# Altium project esp32-s3-can-interface.PrjPcb
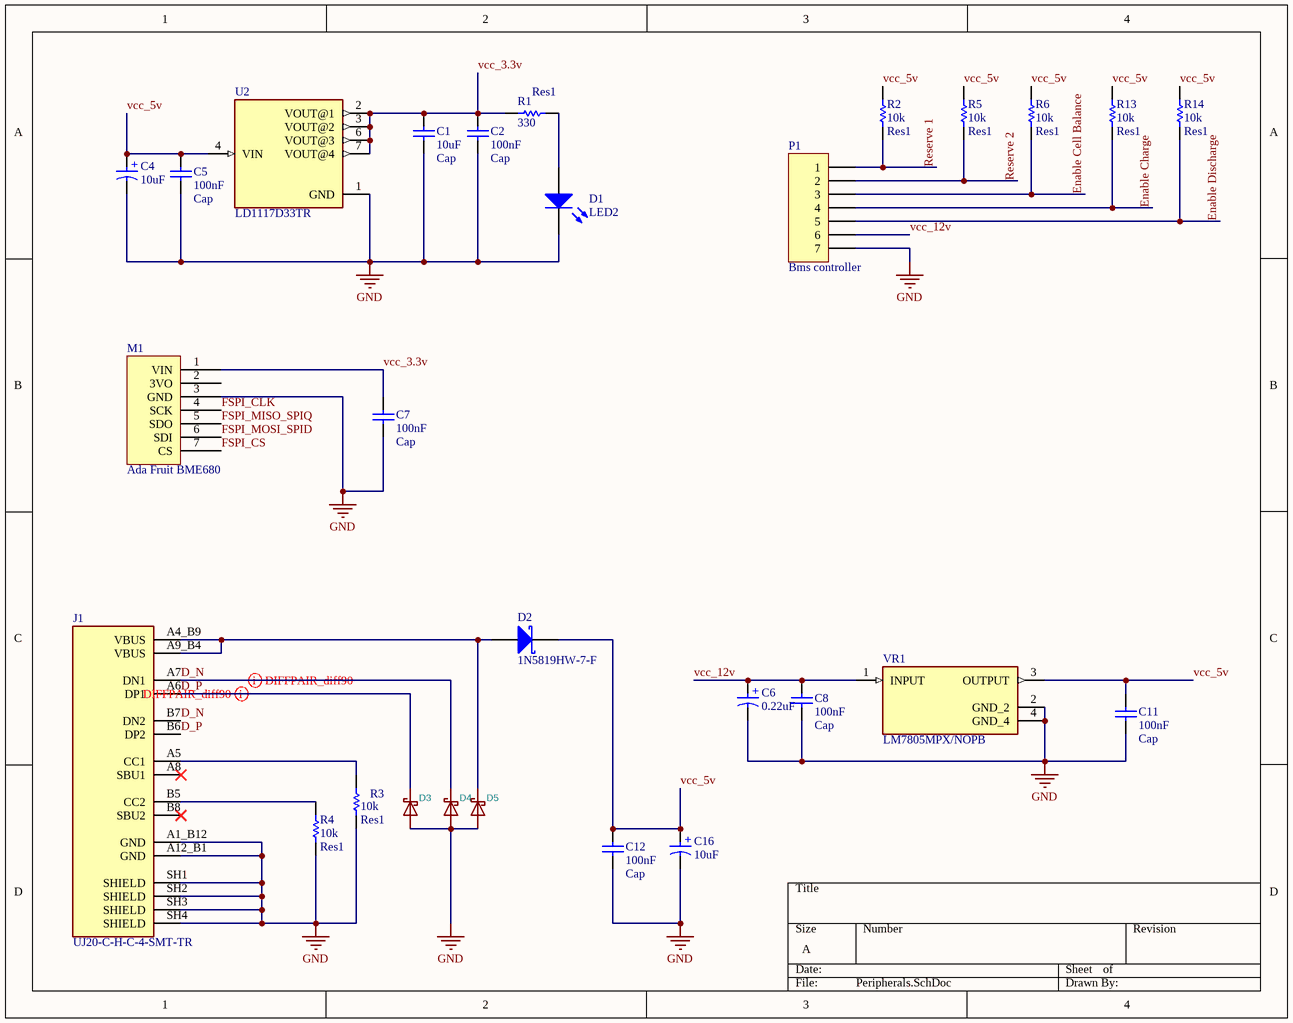
[diagram p0: Peripherals.SchDoc]
2 sheets, 48 parts. Net scope: global (net labels, ports and power ports of the same name join across sheets).
Board file: main.PcbDoc
Sheets:
  Peripherals.SchDoc
  ESP32.SchDoc

## Sheet Peripherals.SchDoc
size A; SheetNumber: 1; SheetTotal: 2; SPICEModelCacheRTTYEORK: <root> / <DocumentId>RTTYEORK</DocumentId> / <CacheFrame Number="0"> / <Model Name="led2" Kind="MDL"> / <Text>*Typ RED,GREEN,YELLOW,AMBER GaAs LED: Vf=2.1V Vr=4V If=40mA trr=3uS / *LED Pinout: 1=A, 2=K / .MODEL LED2 D (IS=93.1P RS=42M N=4.61 BV=4 IBV=10U / + CJO=2.97P VJ=.75 M=.333 TT=4.32U)</Text> / </Model> / <Model Name="skydiode" Kind="MDL"> / <Text>*Default Schottky Diode / *Schottky Diode Pinout: A,K / .MODEL SKYDIODE D(EG=0.69 XTI=2)</Text> / </Model> / <Model Name="865060643005_10uf" Kind="CKT"> / <Text>******* / .subckt 865060643005_10uF 1 2 / Rser 1 3 0.86 / Lser 2 4 0.000000002536 / C1 3 4 0.00001 / Rpar 3 4 10000000 / .ends 865060643005_10uF</Text> / </Model> / </CacheFrame> / </root>

### Parts
C1  Cap  value 10uF  [6-0805_L]
C2  Cap  value 100nF  [6-0805_L]
C4  10uF  [WCAP-ASLL_D6.3H5.5]
C5  Cap  value 100nF  [6-0805_L]
C6  0.22uF  [WCAP-ASLL_D6.3H5.5]
C7  Cap  value 100nF  [6-0805_L]
C8  Cap  value 100nF  [6-0805_L]
C11  Cap  value 100nF  [6-0805_L]
C12  Cap  value 100nF  [6-0805_L]
C16  10uF  [WCAP-ASLL_D6.3H5.5]
D1  LED2  [6-0805_N]
D2  1N5819HW-7-F  [SMB]
D3  Schottky-Diode  [SOD-523]  (value not drawn)
D4  Schottky-Diode  [SOD-523]  (value not drawn)
D5  Schottky-Diode  [SOD-523]  (value not drawn)
J1  UJ20-C-H-C-4-SMT-TR  [CUI_UJ20-C-H-C-4-SMT-TR]
M1  Ada Fruit BME680  [Ada Fruit BME680]
P1  Bms controller  [HDR1X7]
R1  Res1  value 330  [6-0805_N]
R2  Res1  value 10k  [6-0805_N]
R3  Res1  value 10k  [6-0805_N]
R4  Res1  value 10k  [6-0805_N]
R5  Res1  value 10k  [6-0805_N]
R6  Res1  value 10k  [6-0805_N]
R13  Res1  value 10k  [6-0805_N]
R14  Res1  value 10k  [6-0805_N]
U2  LD1117D33TR  [SOIC127P600X175-8N]
VR1  LM7805MPX/NOPB  [VREG_LM7805MPX/NOPB]

### Nets
GND: C1.1 C2.1 C4.2(N) C5.1 C6.2(N) C7.1 C8.1 C11.1 C12.1 C16.2(N) D1.2(K) D3.A D4.A D5.A J1.A1_B12(GND) J1.A12_B1(GND) J1.SH1(SHIELD) J1.SH2(SHIELD) J1.SH3(SHIELD) J1.SH4(SHIELD) M1.3(GND) P1.7 R3.1 R4.1 U2.1(GND) VR1.2(GND_2) VR1.4(GND_4)
D_N: D4.K J1.A7(DN1) J1.B7(DN2)
D_P: D3.K J1.A6(DP1) J1.B6(DP2)
Enable Cell Balance: P1.3 R6.1
Enable Charge: P1.4 R13.1
Enable Discharge: P1.5 R14.1
FSPI_CLK: M1.4(SCK)
FSPI_CS: M1.7(CS)
FSPI_MISO_SPIQ: M1.5(SDO)
FSPI_MOSI_SPID: M1.6(SDI)
Reserve 1: P1.1 R2.1
Reserve 2: P1.2 R5.1
vcc_3.3v: C1.2 C2.2 C7.2 M1.1(VIN) R1.1 U2.2(VOUT@1) U2.3(VOUT@2) U2.6(VOUT@3) U2.7(VOUT@4)
vcc_5v: C4.1(P) C5.2 C11.2 C12.2 C16.1(P) D2.2(K) R2.2 R5.2 R6.2 R13.2 R14.2 U2.4(VIN) VR1.3(OUTPUT)
vcc_12v: C6.1(P) C8.2 P1.6 VR1.1(INPUT)
NetD1_1: D1.1(A) R1.2
NetD2_1: D2.1(A) D5.K J1.A4_B9(VBUS) J1.A9_B4(VBUS)
NetJ1_A5: J1.A5(CC1) R3.2
NetJ1_B5: J1.B5(CC2) R4.2

Not connected (* = marked no-connect by the designer): J1 A8(SBU1)* B8(SBU2)*; M1 2(3VO)

### Layout directives
differential pair; differential pair class diff90: D_N, D_P

### Notes on the sheet
- (in symbol 865060643005) +

### Library data of the parts
C1 C2 C5 C7 C8 C11 C12 = Cap: Capacitor; Published: 8-Jun-2000; LatestRevisionDate: 17-Jul-2002; LatestRevisionNote: Re-released for DXP Platform.; PackageReference: RAD-0.3; Publisher: Altium Limited; PackageDescription: Radial Cap, Thru-Hole; 2 Leads; 0.3 in Pin Spacing
C4 C6 C16 = 865060643005: WCAP-ASLL Aluminum Electrolytic Capacitor, V-Chip, SMT, D6.3 x H5.5mm, 10uF, 50V; Manufacturer: Wurth Elektronik; Capacitance Tolerance: +/-20%; Dissipation Factor: 12%; Endurance: 2000h; Leakage Current: 5uA; Ripple Current: 165mA; Technical Reference: ASED055100M050DVCTBB000; Manufacturer Part Number: 865060643005; Category: Aluminum Electrolytic Capacitors; Match Code: WCAP-ASLL; ComponentLink1Description: Website Link; ComponentLink1URL: https://www.we-online.com/redexpert/article/865060643005?ad; ComponentLink2Description: Datasheet Link; ComponentLink2URL: https://www.we-online.com/redexpert/spec/865060643005?ad; Mount: Surface Mount; Operating Temperature Max: 105°C; Operating Temperature Min: -55°C; Packaging: Tape and Reel; Height: 5.5mm; Diameter: 6.3mm; Capacitance: 10uF; Rated Voltage (DC): 50V
D1 = LED2: Typical RED, GREEN, YELLOW, AMBER GaAs LED; Published: 8-Jun-2000; LatestRevisionDate: 17-Jul-2002; LatestRevisionNote: Re-released for DXP Platform.; PackageVersion: Feb-2002; PackageReference: 3.2X1.6X1.1; Publisher: Altium Limited; PackageDescription: SM LED; 2 Flat Leads
D2 = D Schottky: Schottky Diode; Published: 8-Jun-2000; LatestRevisionDate: 17-Jul-2002; LatestRevisionNote: Re-released for DXP Platform.; PackageReference: SMB; Publisher: Altium Limited; PackageDescription: DO-214-AA/SMB; 2 C-Bend Leads; Body 5.3 x 3.6 mm, inc. leads (LxW); Code_JEDEC: DO-214-AA
D3-D5 = Schottky-Diode: ki_description: Schottky Diode; Value: Shottky-Diode; Reference: D; Datasheet: https://diotec.com/de/produktliste/SBD.html; ki_keywords: Schottky
M1 = Ada Fruit BME680: BME680 sensor module
P1 = Header 7: Header, 7-Pin; LatestRevisionDate: 17-Jul-2002; LatestRevisionNote: Re-released for DXP Platform.; Publisher: Altium Limited
R1-R6 R13 R14 = Res1: Resistor; Published: 8-Jun-2000; LatestRevisionDate: 17-Jul-2002; LatestRevisionNote: Re-released for DXP Platform.; PackageReference: AXIAL-0.3; Publisher: Altium Limited; PackageDescription: Axial Device, Thru-Hole; 2 Leads; 0.3 in Pin Spacing
U2 = LD1117D33TR: Linear Voltage Regulator IC Positive Fixed 1 Output 800mA 8-SOIC; MF: STMicroelectronics; SnapEDA_Link: https://www.snapeda.com/parts/LD1117D33TR/STMicroelectronics/view-part/?ref=snap; Package: SO-8 STMicroelectronics; Value: *; MP: LD1117D33TR; Check_prices: https://www.snapeda.com/parts/LD1117D33TR/STMicroelectronics/view-part/?ref=eda
VR1 = LM7805MPX/NOPB: 1.5-A, 30-V, linear voltage regulator 4-SOT-223 0 to 125; Price: None; Value: *; Package: None; Availability: Unavailable; MP: LM7805MPX/NOPB
J1 = UJ20-C-H-C-4-SMT-TR: Package: None; Price: None; Value: *; MP: UJ20-C-H-C-4-SMT-TR; Availability: Unavailable

## Sheet ESP32.SchDoc
size A; SheetNumber: 2; SheetTotal: 2; SPICEModelCacheHYKVYYBT: <root> / <DocumentId>HYKVYYBT</DocumentId> / <CacheFrame Number="0"> / <Model Name="irf1010" Kind="CKT"> / <Text>*IRF1010 MCE 4-2-96 / *55V  75A .014 ohm HEXFET pkg:TO-220 2,1,3 / .SUBCKT IRF1010  10 20 40 40 / M1   1  2  3  3  DMOS L=1U W=1U / RD  10  1  5.65M / RS  30  3  1.35M / RG  20  2  12.1 / CGS  2  3  2.15N / EGD 12  0  2  1  1 / VFB 14  0  0 / FFB  2  1  VFB  1 / CGD 13 14  4.49N / R1  13  0  1 / D1  12 13  DLIM / DDG 15 14  DCGD / R2  12 15  1 / D2  15  0  DLIM / DSD  3 10  DSUB / LS  30 40  7.5N / .MODEL DMOS NMOS (LEVEL=3 THETA=60M VMAX=114K ETA=2M VTO=3 KP=19.4) / .MODEL DCGD D (CJO=4.49N VJ=.6 M=.68) / .MODEL DSUB D (IS=311N N=1.5 RS=8.67M BV=55 CJO=4.08N VJ=.8 M=.42 TT=100N) / .MODEL DLIM D (IS=100U) / .ENDS IRF1010</Text> / </Model> / <Model Name="865060643005_10uf" Kind="CKT"> / <Text>******* / .subckt 865060643005_10uF 1 2 / Rser 1 3 0.86 / Lser 2 4 0.000000002536 / C1 3 4 0.00001 / Rpar 3 4 10000000 / .ends 865060643005_10uF</Text> / </Model> / </CacheFrame> / </root>
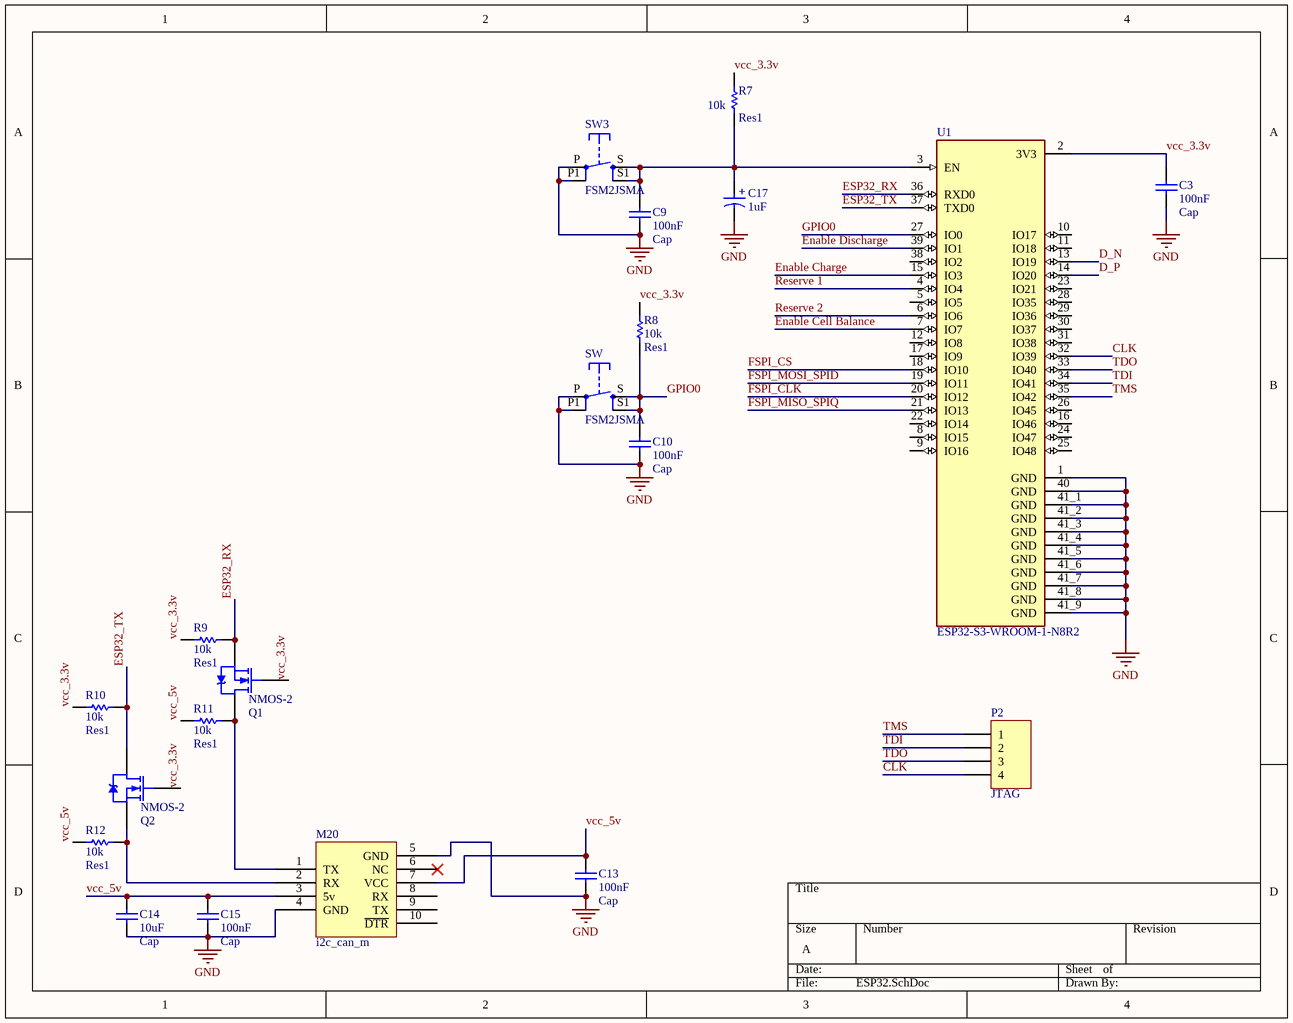
[diagram p1: ESP32.SchDoc]

### Parts
C3  Cap  value 100nF  [6-0805_L]
C9  Cap  value 100nF  [6-0805_L]
C10  Cap  value 100nF  [6-0805_L]
C13  Cap  value 100nF  [6-0805_L]
C14  Cap  value 10uF  [6-0805_L]
C15  Cap  value 100nF  [6-0805_L]
C17  1uF  [SMB]
M20  i2c_can_m  [i2c_can_module]
P2  JTAG  [HDR1X4]
Q1  NMOS-2  [SOT23_N]
Q2  NMOS-2  [SOT23_N]
R7  Res1  value 10k  [6-0805_N]
R8  Res1  value 10k  [6-0805_N]
R9  Res1  value 10k  [6-0805_N]
R10  Res1  value 10k  [6-0805_N]
R11  Res1  value 10k  [6-0805_N]
R12  Res1  value 10k  [6-0805_N]
SW  FSM2JSMA  [FSM2JSMA]
SW3  FSM2JSMA  [FSM2JSMA]
U1  ESP32-S3-WROOM-1-N8R2  [XCVR_ESP32-S3-WROOM-1-N8R2]

### Nets
GND: C3.1 C9.1 C10.1 C13.1 C14.1 C15.1 C17.2(N) M20.4(GND) M20.5(GND) SW.P SW.P1(P@1) SW3.P SW3.P1(P@1) U1.1(GND) U1.40(GND) U1.41_1(GND) U1.41_2(GND) U1.41_3(GND) U1.41_4(GND) U1.41_5(GND) U1.41_6(GND) U1.41_7(GND) U1.41_8(GND) U1.41_9(GND)
CLK: P2.4 U1.32(IO39)
D_N: U1.13(IO19)
D_P: U1.14(IO20)
Enable Cell Balance: U1.7(IO7)
Enable Charge: U1.15(IO3)
Enable Discharge: U1.39(IO1)
ESP32_RX: Q1.3(S) R9.1 U1.36(RXD0)
ESP32_TX: Q2.2(D) R10.2 U1.37(TXD0)
FSPI_CLK: U1.20(IO12)
FSPI_CS: U1.18(IO10)
FSPI_MISO_SPIQ: U1.21(IO13)
FSPI_MOSI_SPID: U1.19(IO11)
GPIO0: C10.2 R8.1 SW.S SW.S1(S@1) U1.27(IO0)
Reserve 1: U1.4(IO4)
Reserve 2: U1.6(IO6)
TDI: P2.2 U1.34(IO41)
TDO: P2.3 U1.33(IO40)
TMS: P2.1 U1.35(IO42)
vcc_3.3v: C3.2 Q1.1(G) Q2.1(G) R7.2 R8.2 R9.2 R10.1 U1.2(3V3)
vcc_5v: C13.2 C14.2 C15.2 M20.3(5v) M20.7(VCC) R11.1 R12.1
NetC9_2: C9.2 C17.1(P) R7.1 SW3.S SW3.S1(S@1) U1.3(EN)
NetM20_1: M20.1(TX) Q1.2(D) R11.2
NetM20_2: M20.2(RX) Q2.3(S) R12.2

Not connected (* = marked no-connect by the designer): M20 6(NC)* 8(RX) 9(TX) 10(~{DTR}); U1 5(IO5) 8(IO15) 9(IO16) 10(IO17) 11(IO18) 12(IO8) 16(IO46) 17(IO9) 22(IO14) 23(IO21) 24(IO47) 25(IO48) 26(IO45) 28(IO35) 29(IO36) 30(IO37) 31(IO38) 38(IO2)

### Notes on the sheet
- (in symbol 865060643005) +

### Library data of the parts
C3 C9 C10 C13-C15 = Cap: Capacitor; Published: 8-Jun-2000; LatestRevisionDate: 17-Jul-2002; LatestRevisionNote: Re-released for DXP Platform.; PackageReference: RAD-0.3; Publisher: Altium Limited; PackageDescription: Radial Cap, Thru-Hole; 2 Leads; 0.3 in Pin Spacing
C17 = 865060643005: as C4 on sheet Peripherals; Manufacturer Part Number: 865060643005; Category: Aluminum Electrolytic Capacitors; Match Code: WCAP-ASLL; ComponentLink1Description: Website Link; ComponentLink1URL: https://www.we-online.com/redexpert/article/865060643005?ad; ComponentLink2Description: Datasheet Link; ComponentLink2URL: https://www.we-online.com/redexpert/spec/865060643005?ad; Mount: Surface Mount; Operating Temperature Max: 105°C; Operating Temperature Min: -55°C; Packaging: Tape and Reel; Height: 5.5mm; Diameter: 6.3mm; Capacitance: 10uF; Rated Voltage (DC): 50V
M20 = i2c_can_m: i2c_can_module
P2 = Header 4: Header, 4-Pin; LatestRevisionDate: 17-Jul-2002; LatestRevisionNote: Re-released for DXP Platform.; Publisher: Altium Limited
Q1 Q2 = NMOS-2: N-Channel Power MOSFET; Note: Pin 2 is electrically connected to pin 4.; Published: 8-Jun-2000; LatestRevisionDate: 17-Jul-2002; LatestRevisionNote: Re-released for DXP Platform.; DatasheetVersion: PD-9.814; PackageVersion: Feb-1997; PackageReference: TO-220AB; Publisher: Altium Limited; PackageDescription: TO, Thru-Hole, Vertical, Heatsink Mounted; 3 In-Line Leads; Pitch 2.54 mm; ComponentLink1Description: Manufacturer Link; ComponentLink1URL: http://www.irf.com/
R7-R12 = Res1: Resistor; Published: 8-Jun-2000; LatestRevisionDate: 17-Jul-2002; LatestRevisionNote: Re-released for DXP Platform.; PackageReference: AXIAL-0.3; Publisher: Altium Limited; PackageDescription: Axial Device, Thru-Hole; 2 Leads; 0.3 in Pin Spacing
SW SW3 = FSM2JSMA: Tactile Switch SPST-NO Top Actuated Surface Mount; MF: TE Connectivity; MP: FSM-2J-SMA; Availability: Unavailable; TE_purchase_URL: https://www.te.com/usa-en/product-FSM-2J-SMA.html?te_bu=Cor&te_type=disp&te_campaign=seda_glo_cor-seda-global-disp-prtnr-fy19-seda-model-bom-cta_sma-317_1&elqCampaignId=32493; Value: *; Price: None; SnapEDA_Link: https://www.snapeda.com/parts/FSM-2J-SMA/TE%20Connectivity%20ALCOSWITCH%20Switches/view-part/524299/?ref=snap; Package: None
U1 = ESP32-S3-WROOM-1-N8R2: WiFi 802.11a/b/g/n, Bluetooth v5.0 Transceiver Module 2.4GHz Antenna Not Included -; MF: Espressif Systems; Package: - Espressif Systems; Price: None; Check_prices: https://www.snapeda.com/parts/ESP32-S3-WROOM-1-N8R2/Espressif+Systems/view-part/?ref=eda; Value: *; SnapEDA_Link: https://www.snapeda.com/parts/ESP32-S3-WROOM-1-N8R2/Espressif+Systems/view-part/?ref=snap; MP: ESP32-S3-WROOM-1-N8R2; Availability: In Stock; Purchase-URL: https://pricing.snapeda.com/search?q=ESP32-S3-WROOM-1-N8R2&ref=eda

## Nets that join several sheets
GND: Peripherals (27 pins), ESP32 (24 pins)
D_N: Peripherals (D4.K J1.A7 J1.B7), ESP32 (U1.13)
D_P: Peripherals (D3.K J1.A6 J1.B6), ESP32 (U1.14)
Enable Cell Balance: Peripherals (P1.3 R6.1), ESP32 (U1.7)
Enable Charge: Peripherals (P1.4 R13.1), ESP32 (U1.15)
Enable Discharge: Peripherals (P1.5 R14.1), ESP32 (U1.39)
FSPI_CLK: Peripherals (M1.4), ESP32 (U1.20)
FSPI_CS: Peripherals (M1.7), ESP32 (U1.18)
FSPI_MISO_SPIQ: Peripherals (M1.5), ESP32 (U1.21)
FSPI_MOSI_SPID: Peripherals (M1.6), ESP32 (U1.19)
Reserve 1: Peripherals (P1.1 R2.1), ESP32 (U1.4)
Reserve 2: Peripherals (P1.2 R5.1), ESP32 (U1.6)
vcc_3.3v: Peripherals (9 pins), ESP32 (8 pins)
vcc_5v: Peripherals (13 pins), ESP32 (7 pins)